# Altium schematic sheet smoothieboard-5driver_0.SchDoc
size 409 x 279 mm; Date: 9/15/2017 15:08:36; Organization: Altium Limited; Address1: L3, 12a Rodborough Rd; Address2: Frenchs Forest; Address3: NSW; Address4: Australia 2086; Origin: Eagle
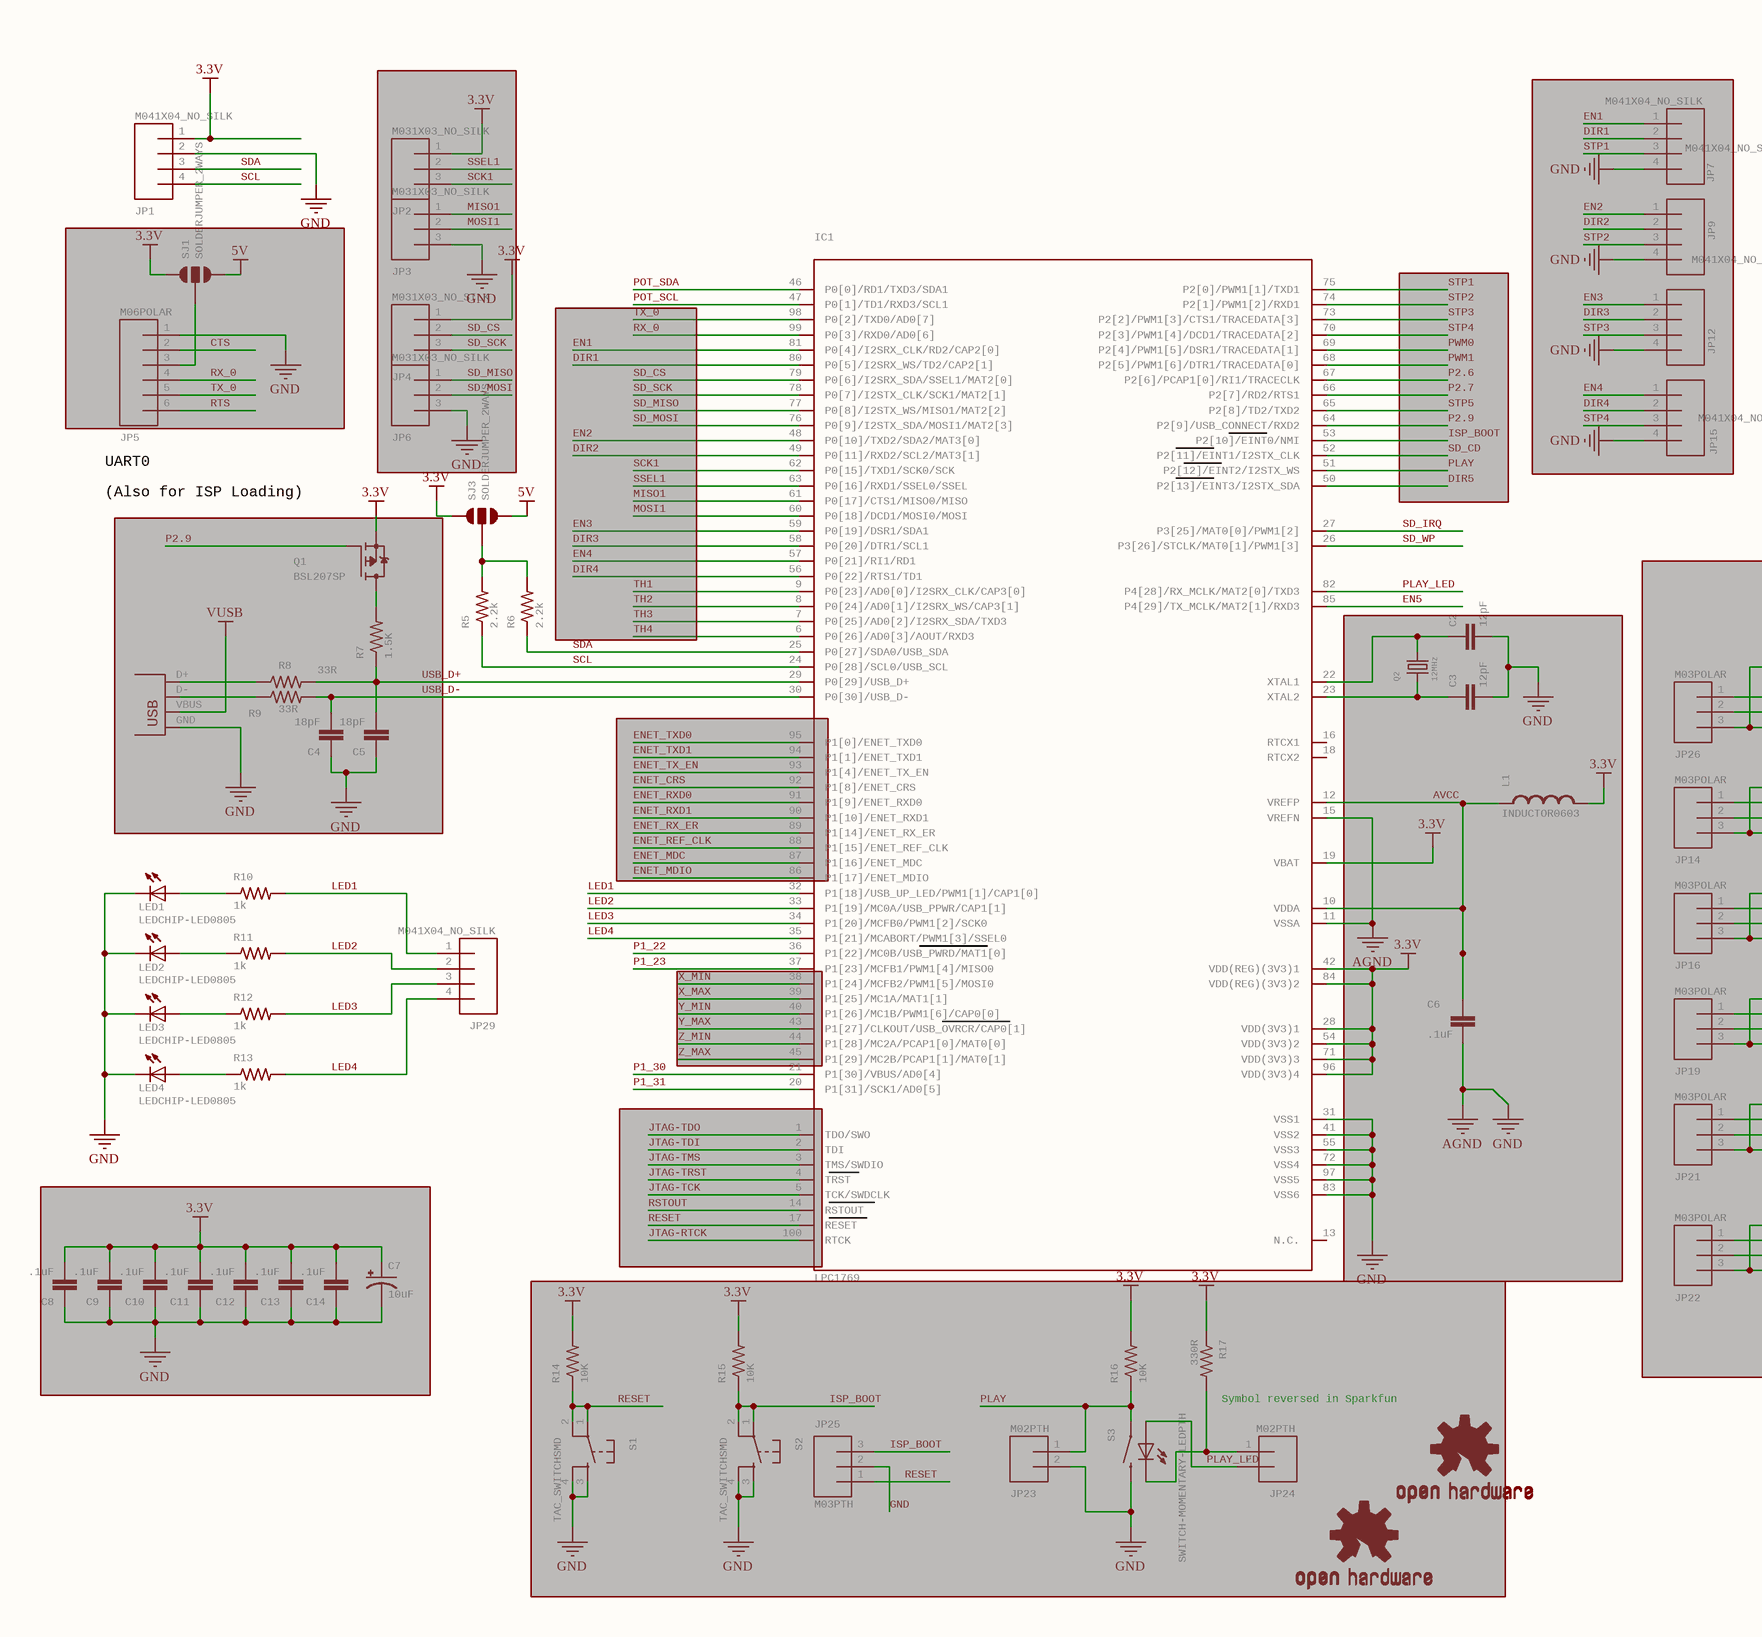
[diagram p0: smoothieboard-5driver_0.SchDoc, left]
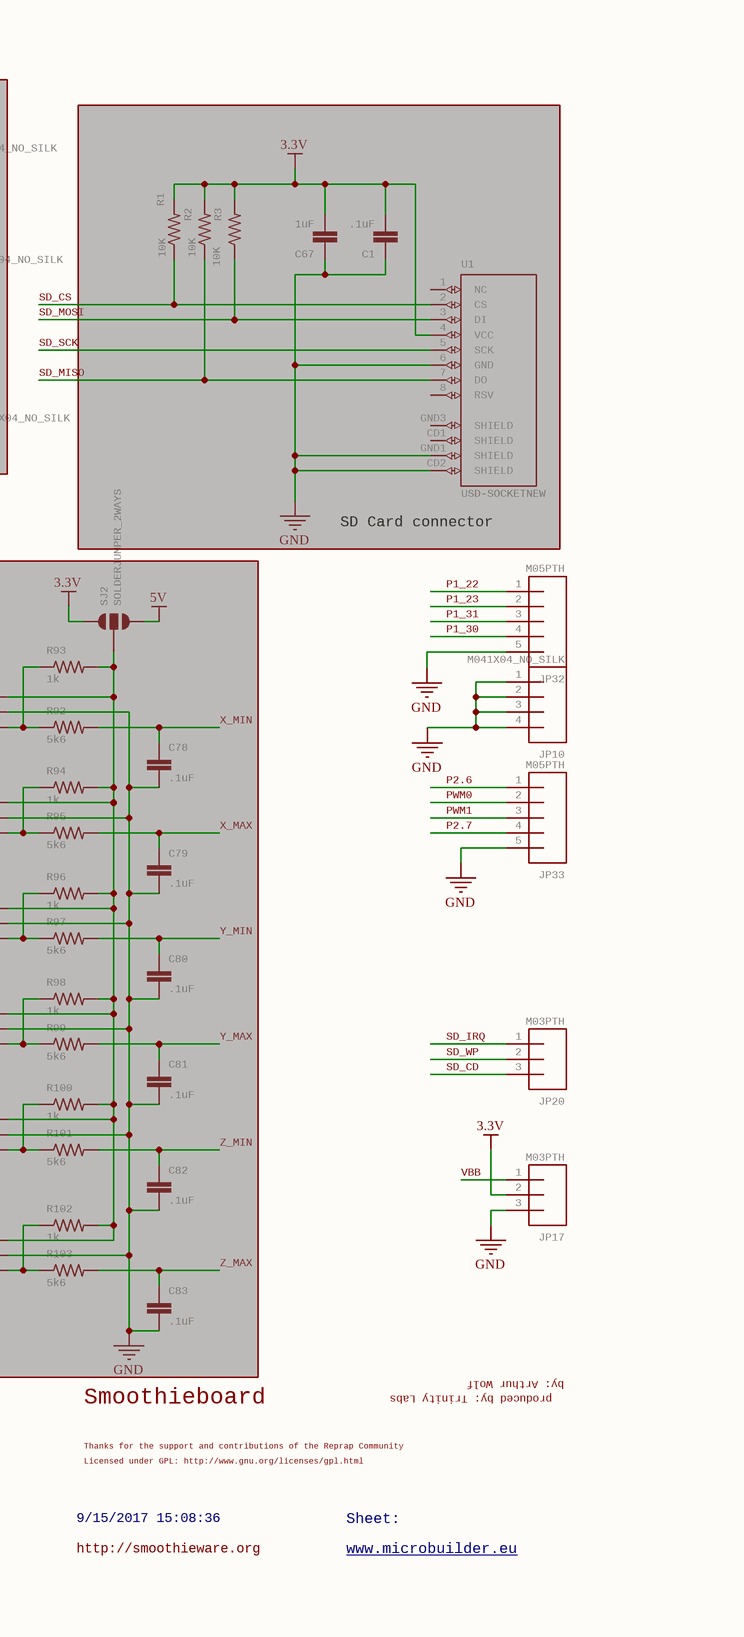
[diagram p1: smoothieboard-5driver_0.SchDoc, right]

## Parts
C1  .1uF  [C0603]
C2  12pF  [C0603]
C3  12pF  [C0603]
C4  18pF  [C0603]
C5  18pF  [C0603]
C6  .1uF  [C0603]
C7  10uF  [EIA3216]
C8  .1uF  [C0603]
C9  .1uF  [C0603]
C10  .1uF  [C0603]
C11  .1uF  [C0603]
C12  .1uF  [C0603]
C13  .1uF  [C0603]
C14  .1uF  [C0603]
C67  1uF  [C0805]
C78  .1uF  [C0603]
C79  .1uF  [C0603]
C80  .1uF  [C0603]
C81  .1uF  [C0603]
C82  .1uF  [C0603]
C83  .1uF  [C0603]
IC1  LPC1769  [LQFP100]
JP1  M041X04_NO_SILK  [1X04_NO_SILK]
JP2  M031X03_NO_SILK  [1X03_NO_SILK]
JP3  M031X03_NO_SILK  [1X03_NO_SILK]
JP4  M031X03_NO_SILK  [1X03_NO_SILK]
JP5  M06POLAR  [MOLEX-1X6]
JP6  M031X03_NO_SILK  [1X03_NO_SILK]
JP7  M041X04_NO_SILK  [1X04_NO_SILK]
JP9  M041X04_NO_SILK  [1X04_NO_SILK]
JP10  M041X04_NO_SILK  [1X04_NO_SILK]
JP12  M041X04_NO_SILK  [1X04_NO_SILK]
JP14  M03POLAR  [MOLEX-1X3]
JP15  M041X04_NO_SILK  [1X04_NO_SILK]
JP16  M03POLAR  [MOLEX-1X3]
JP17  M03PTH  [1X03]
JP19  M03POLAR  [MOLEX-1X3]
JP20  M03PTH  [1X03]
JP21  M03POLAR  [MOLEX-1X3]
JP22  M03POLAR  [MOLEX-1X3]
JP23  M02PTH  [1X02]
JP24  M02PTH  [1X02]
JP25  M03PTH  [1X03]
JP26  M03POLAR  [MOLEX-1X3]
JP29  M041X04_NO_SILK  [1X04_NO_SILK]
JP32  M05PTH  [1X05]
JP33  M05PTH  [1X05]
L1  INDUCTOR0603  [0603]
LED1  LEDCHIP-LED0805  [CHIP-LED0805]
LED2  LEDCHIP-LED0805  [CHIP-LED0805]
LED3  LEDCHIP-LED0805  [CHIP-LED0805]
LED4  LEDCHIP-LED0805  [CHIP-LED0805]
Q1  BSL207SP  [SC74_INFINEON]
Q2  12MHz  [CRYSTAL_3.2X2.5]
R1  10K  [R0603]
R2  10K  [R0603]
R3  10K  [R0603]
R5  2.2k  [R0603]
R6  2.2k  [R0603]
R7  1.5K  [R0603]
R8  33R  [R0603]
R9  33R  [R0603]
R10  1k  [R0603]
R11  1k  [R0603]
R12  1k  [R0603]
R13  1k  [R0603]
R14  10K  [R0603]
R15  10K  [R0603]
R16  10K  [R0603]
R17  330R  [R0603]
R92  5k6  [R0603]
R93  1k  [R0603]
R94  1k  [R0603]
R95  5k6  [R0603]
R96  1k  [R0603]
R97  5k6  [R0603]
R98  1k  [R0603]
R99  5k6  [R0603]
R100  1k  [R0603]
R101  5k6  [R0603]
R102  1k  [R0603]
R103  5k6  [R0603]
S1  TAC_SWITCHSMD  [TACTILE_SWITCH_SMD]
S2  TAC_SWITCHSMD  [TACTILE_SWITCH_SMD]
S3  SWITCH-MOMENTARY-LEDPTH  [TACTILE-PTH-LED-12MM]
SJ1  SOLDERJUMPER_2WAYS  [SJ_3]
SJ2  SOLDERJUMPER_2WAYS  [SJ_3]
SJ3  SOLDERJUMPER_2WAYS  [SJ_3]
U1  USD-SOCKETNEW  [MICRO-SD-SOCKET-PP]
U$8  OSHW-LOGOH  [OSHW-LOGO-HUGE]  (value not drawn)
U$9  OSHW-LOGOH  [OSHW-LOGO-HUGE]  (value not drawn)
X14  USBPTH  [USB-B-PTH]  (value not drawn)

## Blocks framed on the sheet
SD Card connector: C1 C67 R1-R3 U1
Symbol reversed in Sparkfun: JP23-JP25 R14-R17 S1-S3 U$8 U$9

## Nets
3.3V: C1.2 C7.A(+) C8.2 C9.2 C10.2 C11.2 C12.2 C13.2 C14.2 C67.2 IC1.19(VBAT) IC1.28(VDD(3V3)1) IC1.42(VDD(REG)(3V3)1) IC1.54(VDD(3V3)2) IC1.71(VDD(3V3)3) IC1.84(VDD(REG)(3V3)2) IC1.96(VDD(3V3)4) JP1.1 JP2.1 JP4.1 JP17.2 L1.2 Q1.4(S) R1.2 R2.2 R3.2 R14.2 R15.2 R16.2 R17.1 SJ1.1 SJ2.1 SJ3.1 U1.4(VCC)
5V: SJ1.3 SJ2.3 SJ3.3
GND: C1.1 C2.2 C3.2 C4.1 C5.1 C6.2 C7.C(-) C8.1 C9.1 C10.1 C11.1 C12.1 C13.1 C14.1 C67.1 C78.2 C79.2 C80.2 C81.2 C82.2 C83.2 IC1.11(VSSA) IC1.15(VREFN) IC1.31(VSS1) IC1.41(VSS2) IC1.55(VSS3) IC1.72(VSS4) IC1.83(VSS6) IC1.97(VSS5) JP1.2 JP3.3 JP5.1 JP6.3 JP7.4 JP9.4 JP10.1 JP10.2 JP10.3 JP10.4 JP12.4 JP14.2 JP15.4 JP16.2 JP17.3 JP19.2 JP21.2 JP22.2 JP23.2 JP25.2 JP26.2 JP32.5 JP33.5 LED1.C LED2.C LED3.C LED4.C S1.3 S1.4 S2.3 S2.4 S3.2 U1.6(GND) U1.CD2(SHIELD) U1.GND1(SHIELD) X14.GND  [also labelled AGND]
VUSB: X14.VBUS
AVCC: C6.1 IC1.10(VDDA) IC1.12(VREFP) L1.1
CTS: JP5.2
DIR1: IC1.80(P0[5]/I2SRX_WS/TD2/CAP2[1]) JP7.2
DIR2: IC1.49(P0[11]/RXD2/SCL2/MAT3[1]) JP9.2
DIR3: IC1.58(P0[20]/DTR1/SCL1) JP12.2
DIR4: IC1.56(P0[22]/RTS1/TD1) JP15.2
DIR5: IC1.50(P2[13]/EINT3/I2STX_SDA)
EN1: IC1.81(P0[4]/I2SRX_CLK/RD2/CAP2[0]) JP7.1
EN2: IC1.48(P0[10]/TXD2/SDA2/MAT3[0]) JP9.1
EN3: IC1.59(P0[19]/DSR1/SDA1) JP12.1
EN4: IC1.57(P0[21]/RI1/RD1) JP15.1
EN5: IC1.85(P4[29]/TX_MCLK/MAT2[1]/RXD3)
ENET_CRS: IC1.92(P1[8]/ENET_CRS)
ENET_MDC: IC1.87(P1[16]/ENET_MDC)
ENET_MDIO: IC1.86(P1[17]/ENET_MDIO)
ENET_REF_CLK: IC1.88(P1[15]/ENET_REF_CLK)
ENET_RX_ER: IC1.89(P1[14]/ENET_RX_ER)
ENET_RXD0: IC1.91(P1[9]/ENET_RXD0)
ENET_RXD1: IC1.90(P1[10]/ENET_RXD1)
ENET_TX_EN: IC1.93(P1[4]/ENET_TX_EN)
ENET_TXD0: IC1.95(P1[0]/ENET_TXD0)
ENET_TXD1: IC1.94(P1[1]/ENET_TXD1)
ISP_BOOT: IC1.53(P2[10]/EINT0/NMI) JP25.3 R15.1 S2.1 S2.2
JTAG-RTCK: IC1.100(RTCK)
JTAG-TCK: IC1.5(TCK/SWDCLK)
JTAG-TDI: IC1.2(TDI)
JTAG-TDO: IC1.1(TDO/SWO)
JTAG-TMS: IC1.3(TMS/SWDIO)
JTAG-TRST: IC1.4(TRST)
LED1: IC1.32(P1[18]/USB_UP_LED/PWM1[1]/CAP1[0]) JP29.1 R10.2
LED2: IC1.33(P1[19]/MC0A/USB_PPWR/CAP1[1]) JP29.2 R11.2
LED3: IC1.34(P1[20]/MCFB0/PWM1[2]/SCK0) JP29.3 R12.2
LED4: IC1.35(P1[21]/MCABORT/PWM1[3]/SSEL0) JP29.4 R13.2
MISO1: IC1.61(P0[17]/CTS1/MISO0/MISO) JP3.1
MOSI1: IC1.60(P0[18]/DCD1/MOSI0/MOSI) JP3.2
P1_22: IC1.36(P1[22]/MC0B/USB_PWRD/MAT1[0]) JP32.1
P1_23: IC1.37(P1[23]/MCFB1/PWM1[4]/MISO0) JP32.2
P1_30: IC1.21(P1[30]/VBUS/AD0[4]) JP32.4
P1_31: IC1.20(P1[31]/SCK1/AD0[5]) JP32.3
P2.6: IC1.67(P2[6]/PCAP1[0]/RI1/TRACECLK) JP33.1
P2.7: IC1.66(P2[7]/RD2/RTS1) JP33.4
P2.9: IC1.64(P2[9]/USB_CONNECT/RXD2) Q1.3(G)
PLAY: IC1.51(P2[12]/EINT2/I2STX_WS) JP23.1 R16.1 S3.4
PLAY_LED: IC1.82(P4[28]/RX_MCLK/MAT2[0]/TXD3) JP24.2 S3.A
POT_SCL: IC1.47(P0[1]/TD1/RXD3/SCL1)
POT_SDA: IC1.46(P0[0]/RD1/TXD3/SDA1)
PWM0: IC1.69(P2[4]/PWM1[5]/DSR1/TRACEDATA[1]) JP33.2
PWM1: IC1.68(P2[5]/PWM1[6]/DTR1/TRACEDATA[0]) JP33.3
RESET: IC1.17(RESET) JP25.1 R14.1 S1.1 S1.2
RSTOUT: IC1.14(RSTOUT)
RTS: JP5.6
RX_0: IC1.99(P0[3]/RXD0/AD0[6]) JP5.4
SCK1: IC1.62(P0[15]/TXD1/SCK0/SCK) JP2.3
SCL: IC1.24(P0[28]/SCL0/USB_SCL) JP1.4 R5.1
SD_CD: IC1.52(P2[11]/EINT1/I2STX_CLK) JP20.3
SD_CS: IC1.79(P0[6]/I2SRX_SDA/SSEL1/MAT2[0]) JP4.2 R1.1 U1.2(CS)
SD_IRQ: IC1.27(P3[25]/MAT0[0]/PWM1[2]) JP20.1
SD_MISO: IC1.77(P0[8]/I2STX_WS/MISO1/MAT2[2]) JP6.1 R2.1 U1.7(DO)
SD_MOSI: IC1.76(P0[9]/I2STX_SDA/MOSI1/MAT2[3]) JP6.2 R3.1 U1.3(DI)
SD_SCK: IC1.78(P0[7]/I2STX_CLK/SCK1/MAT2[1]) JP4.3 U1.5(SCK)
SD_WP: IC1.26(P3[26]/STCLK/MAT0[1]/PWM1[3]) JP20.2
SDA: IC1.25(P0[27]/SDA0/USB_SDA) JP1.3 R6.1
SSEL1: IC1.63(P0[16]/RXD1/SSEL0/SSEL) JP2.2
STP1: IC1.75(P2[0]/PWM1[1]/TXD1) JP7.3
STP2: IC1.74(P2[1]/PWM1[2]/RXD1) JP9.3
STP3: IC1.73(P2[2]/PWM1[3]/CTS1/TRACEDATA[3]) JP12.3
STP4: IC1.70(P2[3]/PWM1[4]/DCD1/TRACEDATA[2]) JP15.3
STP5: IC1.65(P2[8]/TD2/TXD2)
TH1: IC1.9(P0[23]/AD0[0]/I2SRX_CLK/CAP3[0])
TH2: IC1.8(P0[24]/AD0[1]/I2SRX_WS/CAP3[1])
TH3: IC1.7(P0[25]/AD0[2]/I2SRX_SDA/TXD3)
TH4: IC1.6(P0[26]/AD0[3]/AOUT/RXD3)
TX_0: IC1.98(P0[2]/TXD0/AD0[7]) JP5.5
USB_D+: C5.2 IC1.29(P0[29]/USB_D+) R7.1 R8.2
USB_D-: C4.2 IC1.30(P0[30]/USB_D-) R9.2
VBB: JP17.1
X_MAX: C79.1 IC1.39(P1[25]/MC1A/MAT1[1]) R95.2
X_MIN: C78.1 IC1.38(P1[24]/MCFB2/PWM1[5]/MOSI0) R92.2
Y_MAX: C81.1 IC1.43(P1[27]/CLKOUT/USB_OVRCR/CAP0[1]) R99.2
Y_MIN: C80.1 IC1.40(P1[26]/MC1B/PWM1[6]/CAP0[0]) R97.2
Z_MAX: C83.1 IC1.45(P1[29]/MC2B/PCAP1[1]/MAT0[1]) R103.2
Z_MIN: C82.1 IC1.44(P1[28]/MC2A/PCAP1[0]/MAT0[0]) R101.2
NetC2_1: C2.1 IC1.22(XTAL1) Q2.2
NetC3_1: C3.1 IC1.23(XTAL2) Q2.1
NetJP5_3: JP5.3 SJ1.2
NetJP14_1: JP14.1 JP16.1 JP19.1 JP21.1 JP22.1 JP26.1 R93.2 R94.2 R96.2 R98.2 R100.2 R102.2 SJ2.2
NetJP14_3: JP14.3 R94.1 R95.1
NetJP16_3: JP16.3 R96.1 R97.1
NetJP19_3: JP19.3 R98.1 R99.1
NetJP21_3: JP21.3 R100.1 R101.1
NetJP22_3: JP22.3 R102.1 R103.1
NetJP24_1: JP24.1 R17.2 S3.C
NetJP26_3: JP26.3 R92.1 R93.1
NetLED1_A: LED1.A R10.1
NetLED2_A: LED2.A R11.1
NetLED3_A: LED3.A R12.1
NetLED4_A: LED4.A R13.1
NetQ1_1 2 5 6: Q1.1_2_5_6(D) R7.2
NetR5_2: R5.2 R6.2 SJ3.2
NetR8_1: R8.1 X14.D+
NetR9_1: R9.1 X14.D-

Not connected (* = marked no-connect by the designer): IC1 13(N.C.) 16(RTCX1) 18(RTCX2); U1 1(NC) 8(RSV) CD1(SHIELD) GND3(SHIELD)

## Notes on the sheet
- (near JP5) UART0
- (Also for ISP Loading)
- by: Arthur Wolf
- Smoothieboard
- Thanks for the support and contributions of the Reprap Community
- produced by: Trinity Labs
- 9/15/2017 15:08:36
- Licensed under GPL: http://www.gnu.org/licenses/gpl.html
- Sheet:
- http://smoothieware.org
- www.microbuilder.eu <http://www.microbuilder.eu>
- Title
- Size:
- Date:
- B
- Number:
- Time:
- Revision:
- Sheet
- of
- File:

## Library data of the parts
C1-C6 C8-C14 C78-C83 = C-EUC0603: CAPACITOR, European symbol; GateName_1: G$1; SymbolName_1: C-EU; DeviceName: C0603; DeviceSetName: C-EU
  C1: LibraryName: resistor
  C2-C6 C8-C14 C78-C83: LibraryName: rcl
C7 = CAP_POL1206: Capacitor PolarizedThese are standard SMD and PTH capacitors. Normally 10uF, 47uF, and 100uF in electrolytic and tantalum varieties. Always verify the external diameter of the through hole cap, it varies with capacity, voltage, and manufacturer. The EIA devices should be standard.; GateName_1: G$1; DeviceName: 1206; SymbolName_1: CAP_POL; LibraryName: SparkFun; DeviceSetName: CAP_POL
C67 = C-EUC0805: CAPACITOR, European symbol; GateName_1: G$1; SymbolName_1: C-EU; DeviceName: C0805; LibraryName: resistor; DeviceSetName: C-EU
IC1 = LPC1768: LPC1768    100 MHz 32-bit ARM Cortex-M3 based microcontroller featuring a high level of integration and low power consumption. 512 kB Flash, 64 kB SRAM, USB Device/Host/OTG, Ethernet, CAN, I2S, 10-bit DAC    Digikey: 568-4796-ND; GateName_1: G$1; SymbolName_1: LPC1768_QFP; LibraryName: microbuilder; DeviceSetName: LPC1768
JP1 JP7 JP9 JP10 JP12 JP15 JP29 = M041X04_NO_SILK: Header 4Standard 4-pin 0.1" header. Use with straight break away headers (SKU : PRT-00116), right angle break away headers (PRT-00553), swiss pins (PRT-00743), machine pins (PRT-00117), and female headers (PRT-00115). Molex polarized connector foot print use with SKU : PRT-08231 with associated crimp pins and housings. 1MM SMD Version SKU: PRT-10208; GateName_1: G$1; SymbolName_1: M04; DeviceName: 1X04_NO_SILK; LibraryName: SparkFun; DeviceSetName: M04
JP2-JP4 JP6 = M031X03_NO_SILK: Header 3Standard 3-pin 0.1" header. Use with straight break away headers (SKU : PRT-00116), right angle break away headers (PRT-00553), swiss pins (PRT-00743), machine pins (PRT-00117), and female headers (PRT-00115). Molex polarized connector foot print use with SKU : PRT-08232 with associated crimp pins and housings.; GateName_1: G$1; SymbolName_1: M03; DeviceName: 1X03_NO_SILK; LibraryName: SparkFun; DeviceSetName: M03
JP5 = M06POLAR: Header 6Standard 6-pin 0.1" header. Use with straight break away headers (SKU : PRT-00116), right angle break away headers (PRT-00553), swiss pins (PRT-00743), machine pins (PRT-00117), and female headers (PRT-00115). Molex polarized connector foot print use with SKU : PRT-08094 with associated crimp pins and housings. NOTES ON THE VARIANTS LOCK and LOCK_LONGPADS... This footprint was designed to help hold the alignment of a through-hole component (i.e.  6-pin header) while soldering it into place. You may notice that each hole has been shifted either up or down by 0.005 of an inch from it's more standard position (which is a perfectly straight line). This slight alteration caused the pins (the squares in the middle) to touch the edges of the holes.  Because they are alternating, it causes a "brace" to hold the component in place.  0.005 has proven to be the perfect amount of "off-center" position when using our standard breakaway headers. Although looks a little odd when you look at the bare footprint, once you have a header in there, the alteration is very hard to notice.  Also, if you push a header all the way into place, it is covered up entirely on the bottom side.  This idea of altering the position of holes to aid alignment will be further integrated into the Sparkfun Library for other footprints.  It can help hold any component with 3 or more connection pins.; GateName_1: G$1; SymbolName_1: M06; DeviceName: POLAR; LibraryName: SparkFun; DeviceSetName: M06
JP14 JP16 JP19 JP21 JP22 JP26 = M03POLAR: Header 3Standard 3-pin 0.1" header. Use with straight break away headers (SKU : PRT-00116), right angle break away headers (PRT-00553), swiss pins (PRT-00743), machine pins (PRT-00117), and female headers (PRT-00115). Molex polarized connector foot print use with SKU : PRT-08232 with associated crimp pins and housings.; GateName_1: G$1; SymbolName_1: M03; DeviceName: POLAR; LibraryName: SparkFun; DeviceSetName: M03
JP17 JP20 JP25 = M03PTH: Header 3Standard 3-pin 0.1" header. Use with straight break away headers (SKU : PRT-00116), right angle break away headers (PRT-00553), swiss pins (PRT-00743), machine pins (PRT-00117), and female headers (PRT-00115). Molex polarized connector foot print use with SKU : PRT-08232 with associated crimp pins and housings.; GateName_1: G$1; SymbolName_1: M03; DeviceName: PTH; DeviceSetName: M03
  JP17 JP20: LibraryName: SparkFun
  JP25: LibraryName: SparkFun-Connectors
JP23 JP24 = M02PTH: Header 2Standard 2-pin 0.1" header. Use with straight break away headers (SKU : PRT-00116), right angle break away headers (PRT-00553), swiss pins (PRT-00743), machine pins (PRT-00117), and female headers (PRT-00115). Molex polarized connector foot print use with SKU : PRT-08233 with associated crimp pins and housings.; GateName_1: G$1; SymbolName_1: M02; DeviceName: PTH; LibraryName: SparkFun; DeviceSetName: M02
JP32 JP33 = M05PTH: Header 5Standard 5-pin 0.1" header. Use with straight break away headers (SKU : PRT-00116), right angle break away headers (PRT-00553), swiss pins (PRT-00743), machine pins (PRT-00117), and female headers (PRT-00115). Molex polarized connector foot print use with SKU : PRT-08230 with associated crimp pins and housings.; GateName_1: G$1; SymbolName_1: M05; DeviceName: PTH; LibraryName: SparkFun; DeviceSetName: M05
L1 = INDUCTOR0603: InductorsBasic Inductor/Choke - 0603 and 1206. Footprints are not proven and vary greatly between part numbers.; GateName_1: G$1; SymbolName_1: INDUCTOR; DeviceName: 0603; LibraryName: SparkFun; DeviceSetName: INDUCTOR
LED1-LED4 = LEDCHIP-LED0805: LED   OSRAM: - CHIPLED LG R971, LG N971, LY N971, LG Q971, LY Q971, LO R971, LY R971 LH N974, LH R974 LS Q976, LO Q976, LY Q976 LO Q996 - Hyper CHIPLED LW Q18S LB Q993, LB Q99A, LB R99A - SideLED LS A670, LO A670, LY A670, LG A670, LP A670 LB A673, LV A673, LT A673, LW A673 LH A674 LY A675 LS A676, LA A676, LO A676, LY A676, LW A676 LS A679, LY A679, LG A679 -  Hyper Micro SIDELEDÂ® LS Y876, LA Y876, LO Y876, LY Y876 LT Y87S - SmartLED LW L88C, LW L88S LB L89C, LB L89S, LG L890 LS L89K, LO L89K, LY L89K LS L896, LA L896, LO L896, LY L896 - TOPLED LS T670, LO T670, LY T670, LG T670, LP T670 LSG T670, LSP T670, LSY T670, LOP T670, LYG T670 LG T671, LOG T671, LSG T671 LB T673, LV T673, LT T673, LW T673 LH T674 LS T676, LA T676, LO T676, LY T676, LB T676, LH T676, LSB T676, LW T676 LB T67C, LV T67C, LT T67C, LS T67K, LO T67K, LY T67K, LW E67C LS E67B, LA E67B, LO E67B, LY E67B, LB E67C, LV E67C, LT E67C LW T67C LS T679, LY T679, LG T679 LS T770, LO T770, LY T770, LG T770, LP T770 LB T773, LV T773, LT T773, LW T773 LH T774 LS E675, LA E675, LY E675, LS T675 LS T776, LA T776, LO T776, LY T776, LB T776 LHGB T686 LT T68C, LB T68C - Hyper Mini TOPLEDÂ® LB M676 - Mini TOPLED SantanaÂ® LG M470 LS M47K, LO M47K, LY M47K    Source: http://www.osram.convergy.de   LUXEON: - LUMILEDÂ® LXK2-PW12-R00, LXK2-PW12-S00, LXK2-PW14-U00, LXK2-PW14-V00 LXK2-PM12-R00, LXK2-PM12-S00, LXK2-PM14-U00 LXK2-PE12-Q00, LXK2-PE12-R00, LXK2-PE12-S00, LXK2-PE14-T00, LXK2-PE14-U00 LXK2-PB12-K00, LXK2-PB12-L00, LXK2-PB12-M00, LXK2-PB14-N00, LXK2-PB14-P00, LXK2-PB14-Q00 LXK2-PR12-L00, LXK2-PR12-M00, LXK2-PR14-Q00, LXK2-PR14-R00 LXK2-PD12-Q00, LXK2-PD12-R00, LXK2-PD12-S00 LXK2-PH12-R00, LXK2-PH12-S00 LXK2-PL12-P00, LXK2-PL12-Q00, LXK2-PL12-R00    Source: www.luxeon.com   KINGBRIGHT:   KA-3528ASYC Source: www.kingbright.com; GateName_1: G$1; SymbolName_1: LED; DeviceName: CHIP-LED0805; LibraryName: led; DeviceSetName: LED
Q1 = BSL207SP: OptiMOS(R)-P Small-Signal-Transistor P-Channel, Enhancement mode, Super Logic Level (2.5 V rated)   Source: http://www.infineon.com/upload/Document/BSL207SP_Rev2.01.pdf; GateName_1: G$1; SymbolName_1: P-MOSFET; LibraryName: transistor-fet; DeviceSetName: BSL207SP
Q2 = CRYSTALTHIN: Crystals   HC49UP - Surface Mount Crystal  4.0MHz 18pF +/-30ppm Surface Mount Crystal [Digikey: 535-9857-1-ND]  12.0 MHz Surface Mount Crystal [Digikey: 535-9869-6-ND]  25.0 MHz Surface Mount Crystal [Digikey: 535-9078-1-ND]       3.2 x 2.5mm - MEMs SMT Crystal  12.0 MHz 8pF 15ppm 3.2 x 2.5mm Crystal [Digikey: -10-70Â°C: 644-1047-1-ND -40-125Â°C: 644-1128-1-ND]  16.0 MHz 8pF 15ppm 3.2 x 2.5mm Crystal [Digikey: -10-70Â°C: 644-1049-1-ND -40-125Â°C: 644-1129-2-ND]  16.0 MHz 10pF 10ppm 3.2 x 2.5mm Crystal [Digikey: 644-1100-1-ND]  27.12 MHz 18pF 30ppm 3.2 x 2.5mm Crystal [Digikey: 887-1424-1-ND]  27.12MHz 10pF 10ppm 3.2 x 2.5mm Crystal [Digikey: 887-1329-1-ND]       4.9 x 1.8mm - MEMs SMT Crystal  32.768 KHz 12.5pF 20ppm 4.9 x 1.8mm Crystal [Digikey: SE2415CT-ND]       Cylinder 32.768KHz Cylinder Crystal; GateName_1: G$1; DeviceName: THIN; SymbolName_1: CRYSTAL; LibraryName: microbuilder; DeviceSetName: CRYSTAL
R1-R3 R5-R17 R92-R103 = R-US_R0603: RESISTOR, American symbol; GateName_1: G$1; SymbolName_1: R-US; DeviceSetName: R-US_; DeviceName: R0603; LibraryName: resistor
S1 S2 = TAC_SWITCHSMD: Momentary SwitchButton commonly used for reset or general input. Spark Fun Electronics SKU : COM-00097; GateName_1: S; SymbolName_1: SWITCH-MOMENTARY; DeviceName: SMD; LibraryName: SparkFun; DeviceSetName: TAC_SWITCH
S3 = SWITCH-MOMENTARY-LEDPTH: GateName_1: G$1; DeviceName: PTH; SymbolName_1: SWITCH-MOMENTARY-LED; LibraryName: Local Library; DeviceSetName: SWITCH-MOMENTARY-LED
SJ1-SJ3 = SOLDERJUMPER_2WAYS: Solder Jumper2 way solder jumper; GateName_1: G$1; SymbolName_1: SJ_2; DeviceName: S; LibraryName: SparkFun; DeviceSetName: SOLDERJUMPER_2WAY
U1 = USD-SOCKETNEW: microSD SocketPush-push type uSD socket. Schematic element and footprint production proven. Spark Fun Electronics SKU : PRT-00127. tDoc lines correctly indicate media card edge positions when inserting (unlocked, locked, depressed).; GateName_1: G$1; SymbolName_1: USDCARD; DeviceName: NEW; LibraryName: SparkFun; DeviceSetName: USD-SOCKET
U$8 U$9 = OSHW-LOGOH: Open Source Hardware Logo This logo indicates the piece of hardware it is found on incorporates a OSHW license and/or adheres to the definition of open source hardware found here: http://freedomdefined.org/OSHW; GateName_1: G$1; DeviceName: H; SymbolName_1: OSHW-LOGO; LibraryName: logxen; DeviceSetName: OSHW-LOGO
X14 = USBPTH: USB Connectors   USB-B-PTH is fully proven SKU : PRT-00139    USB-miniB is fully proven SKU : PRT-00587    USB-A-PCB is untested.    USB-A-H is throughly reviewed, but untested. Spark Fun Electronics SKU : PRT-00437    USB-B-SMT is throughly reviewed, but untested. Needs silkscreen touching up.    USB-A-S has not been used/tested    USB-MB-H has not been used/tested; GateName_1: G$1; DeviceName: PTH; SymbolName_1: USB; LibraryName: SparkFun; DeviceSetName: USB; USB: USB